# EAGLE design SDriveARM (EAGLE 7.7.0)
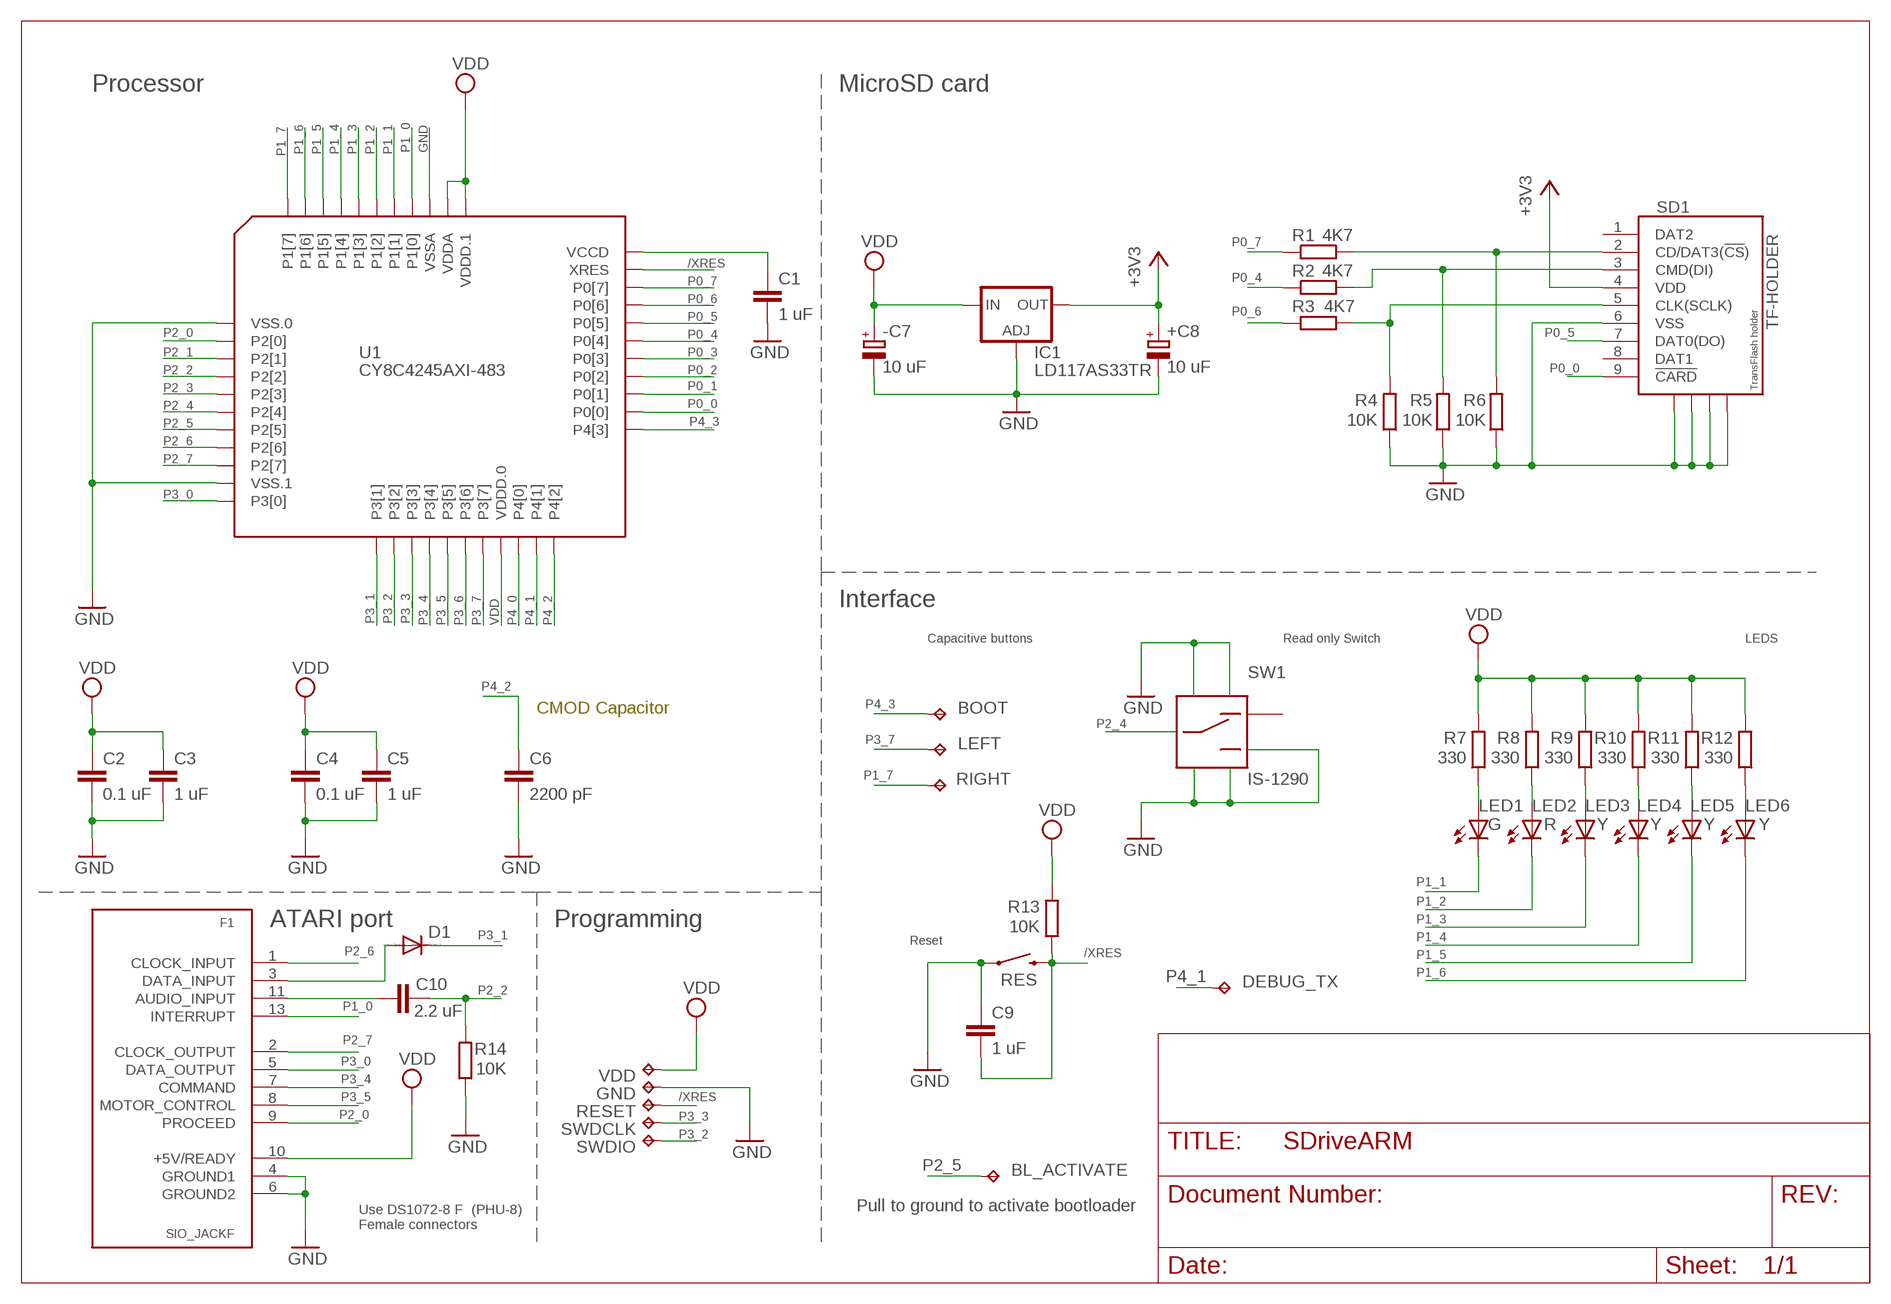
[diagram p0: schematic, sheet 1]

## Parts
+C8  10 uF  CPOL-EUA/3216-18W  [A/3216-18W]
-C7  10 uF  CPOL-EUA/3216-18W  [A/3216-18W]
BL_ACTIVATE  TPB1,27  [B1,27]
BOOT  TPTP20SQ  [TP20SQ]
C1  1 uF  C-EUC0603  [C0603]
C2  0.1 uF  C-EUC0603  [C0603]
C3  1 uF  C-EUC0603  [C0603]
C4  0.1 uF  C-EUC0603  [C0603]
C5  1 uF  C-EUC0603  [C0603]
C6  2200 pF  C-EUC0603  [C0603]
C9  1 uF  C-EUC0603  [C0603]
C10  2.2 uF  C-EUC0603  [C0603]
D1  MBR0520LT  [SOD123]
DEBUG_TX  TPB1,27  [B1,27]
F1  SIO_JACKF  [SIO_JACK_F]
GND  TPB1,27  [B1,27]
IC1  LD117AS33TR  [SOT223]
LED1  G  LEDSML0805  [SML0805]
LED2  R  LEDSML0805  [SML0805]
LED3  Y  LEDSML0805  [SML0805]
LED4  Y  LEDSML0805  [SML0805]
LED5  Y  LEDSML0805  [SML0805]
LED6  Y  LEDSML0805  [SML0805]
LEFT  TPTP20SQ  [TP20SQ]
R1  4K7  R-EU_R0603  [R0603]
R2  4K7  R-EU_R0603  [R0603]
R3  4K7  R-EU_R0603  [R0603]
R4  10K  R-EU_R0603  [R0603]
R5  10K  R-EU_R0603  [R0603]
R6  10K  R-EU_R0603  [R0603]
R7  330  R-EU_R0603  [R0603]
R8  330  R-EU_R0603  [R0603]
R9  330  R-EU_R0603  [R0603]
R10  330  R-EU_R0603  [R0603]
R11  330  R-EU_R0603  [R0603]
R12  330  R-EU_R0603  [R0603]
R13  10K  R-EU_R0603  [R0603]
R14  10K  R-EU_R0603  [R0603]
RES  SWITCH-MOMENTARY-2  [TACTILE_SWITCH_TALL]
RESET  TPB1,27  [B1,27]
RIGHT  TPTP20SQ  [TP20SQ]
SD1  TF-HOLDER  [TF-PULL]
SW1  IS-1290  [IS-1290]
SWDCLK  TPB1,27  [B1,27]
SWDIO  TPB1,27  [B1,27]
U1  CY8C4245AXI-483  [TQFP44]
VDD  TPB1,27  [B1,27]

## Nets
+3V3: +C8.+ IC1.4(OUT) SD1.4(VDD)
/XRES: C9.2 R13.1 RES.B2 RESET.TP U1.32(XRES)
GND: +C8.- -C7.- C1.2 C2.2 C3.2 C4.2 C5.2 C6.2 C9.1 F1.4(GROUND1) F1.6(GROUND2) GND.TP IC1.1(ADJ) R4.1 R5.1 R6.1 R14.1 RES.A2 SD1.6(VSS) SD1.S1 SD1.S2 SD1.S3 SD1.S4 SW1.POS2 SW1.SHIELD$1 SW1.SHIELD$2 SW1.SHIELD$3 SW1.SHIELD$4 U1.1(VSS.0) U1.10(VSS.1) U1.36(VSSA)
N$1: C1.1 U1.33(VCCD)
N$2: C10.2 F1.11(AUDIO_INPUT)
N$3: D1.A F1.3(DATA_INPUT)
N$11: R1.2 R6.2 SD1.2(CD/DAT3(!CS!))
N$12: R2.2 R5.2 SD1.3(CMD(DI))
N$13: R3.2 R4.2 SD1.5(CLK(SCLK))
N$18: LED1.A R7.1
N$19: LED2.A R8.1
N$23: LED3.A R9.1
N$24: LED4.A R10.1
N$25: LED5.A R11.1
N$26: LED6.A R12.1
P0_0: SD1.9(!CARD) U1.24(P0[0])
P0_1: U1.25(P0[1])
P0_2: U1.26(P0[2])
P0_3: U1.27(P0[3])
P0_4: R2.1 U1.28(P0[4])
P0_5: SD1.7(DAT0(DO)) U1.29(P0[5])
P0_6: R3.1 U1.30(P0[6])
P0_7: R1.1 U1.31(P0[7])
P1_0: F1.13(INTERRUPT) U1.37(P1[0])
P1_1: LED1.C U1.38(P1[1])
P1_2: LED2.C U1.39(P1[2])
P1_3: LED3.C U1.40(P1[3])
P1_4: LED4.C U1.41(P1[4])
P1_5: LED5.C U1.42(P1[5])
P1_6: LED6.C U1.43(P1[6])
P1_7: RIGHT.TP U1.44(P1[7])
P2_0: F1.9(PROCEED) U1.2(P2[0])
P2_1: U1.3(P2[1])
P2_2: C10.1 R14.2 U1.4(P2[2])
P2_3: U1.5(P2[3])
P2_4: SW1.COMMON U1.6(P2[4])
P2_5: BL_ACTIVATE.TP U1.7(P2[5])
P2_6: F1.1(CLOCK_INPUT) U1.8(P2[6])
P2_7: F1.2(CLOCK_OUTPUT) U1.9(P2[7])
P3_0: F1.5(DATA_OUTPUT) U1.11(P3[0])
P3_1: D1.C U1.12(P3[1])
P3_2: SWDIO.TP U1.13(P3[2])
P3_3: SWDCLK.TP U1.14(P3[3])
P3_4: F1.7(COMMAND) U1.15(P3[4])
P3_5: F1.8(MOTOR_CONTROL) U1.16(P3[5])
P3_6: U1.17(P3[6])
P3_7: LEFT.TP U1.18(P3[7])
P4_0: U1.20(P4[0])
P4_1: DEBUG_TX.TP U1.21(P4[1])
P4_2: C6.1 U1.22(P4[2])
P4_3: BOOT.TP U1.23(P4[3])
VDD: -C7.+ C2.1 C3.1 C4.1 C5.1 F1.10(+5V/READY) IC1.3(IN) R7.2 R8.2 R9.2 R10.2 R11.2 R12.2 R13.2 U1.19(VDDD.0) U1.34(VDDD.1) U1.35(VDDA) VDD.TP
Unconnected: SD1.1(DAT2) SD1.8(DAT1) SW1.POS1

## Notes on the sheet
- Processor | MicroSD card
- Interface
- Capacitive buttons | Read only Switch | LEDS
- CMOD Capacitor
- ATARI port | Programming
- Reset
- Pull to ground to activate bootloader
- Use DS1072-8 F  (PHU-8) 
  Female connectors

## Library data of the parts
+C8 -C7 = resistor:CPOL-EU: POLARIZED CAPACITOR, European symbol
BL_ACTIVATE BOOT DEBUG_TX GND LEFT RESET RIGHT SWDCLK SWDIO VDD = testpad:TP: Test pad
C1-C6 C9 C10 = resistor:C-EU: CAPACITOR, European symbol
D1 = diode:MBR0520LT: SCHOTTKY BARRIER RECTIFIER Source: http://onsemi.com .. MBR0520LT1-D.pdf
F1 = atari:SIO_JACK: SIO Jack
IC1 = v-reg:LD117A?*: Low drop fixed and adjustable positive voltage regulators 1 A Source: http://www.st.com/stonline/products/literature/ds/7194/ld1117axx.pdf
LED1-LED6 = led:LED: LED OSRAM: - CHIPLED LG R971, LG N971, LY N971, LG Q971, LY Q971, LO R971, LY R971 LH N974, LH R974 LS Q976, LO Q976, LY Q976 LO Q996 - Hyper CHIPLED LW Q18S LB Q993, LB Q99A, LB R99A - SideLED LS A670, LO A670, LY A670, LG A670, LP A670 LB A673, LV A673, LT A673, LW A673 LH A674 LY A675 LS A676, LA A676, LO A676, LY A676, LW A676 LS A679, LY A679, LG A679 - Hyper Micro SIDELED® LS Y876, LA Y876, LO Y876, LY Y876 LT Y87S - SmartLED LW L88C, LW L88S LB L89C, LB L89S, LG L890 LS L89K, LO L89K, LY L89K LS L896, LA L896, LO L896, LY L896 - TOPLED LS T670, LO T670, LY T670, LG T670, LP T670 LSG T670, LSP T670, LSY T670, LOP T670, LYG T670 LG T671, LOG T671, LSG T671 LB T673, LV T673, LT T673, LW T673 LH T674 LS T676, LA T676, LO T676, LY T676, LB T676, LH T676, LSB T676, LW T676 LB T67C, LV T67C, LT T67C, LS T67K, LO T67K, LY T67K, LW E67C LS E67B, LA E67B, LO E67B, LY E67B, LB E67C, LV E67C, LT E67C LW T67C LS T679, LY T679, LG T679 LS T770, LO T770, LY T770, LG T770, LP T770 LB T773, LV T773, LT T773, LW T773 LH T774 LS E675, LA E675, LY E675, LS T675 LS T776, LA T776, LO T776, LY T776, LB T776 LHGB T686 LT T68C, LB T68C - Hyper Mini TOPLED® LB M676 - Mini TOPLED Santana® LG M470 LS M47K, LO M47K, LY M47K Source: http://www.osram.convergy.de LUXEON: - LUMILED® LXK2-PW12-R00, LXK2-PW12-S00, LXK2-PW14-U00, LXK2-PW14-V00 LXK2-PM12-R00, LXK2-PM12-S00, LXK2-PM14-U00 LXK2-PE12-Q00, LXK2-PE12-R00, LXK2-PE12-S00, LXK2-PE14-T00, LXK2-PE14-U00 LXK2-PB12-K00, LXK2-PB12-L00, LXK2-PB12-M00, LXK2-PB14-N00, LXK2-PB14-P00, LXK2-PB14-Q00 LXK2-PR12-L00, LXK2-PR12-M00, LXK2-PR14-Q00, LXK2-PR14-R00 LXK2-PD12-Q00, LXK2-PD12-R00, LXK2-PD12-S00 LXK2-PH12-R00, LXK2-PH12-S00 LXK2-PL12-P00, LXK2-PL12-Q00, LXK2-PL12-R00 Source: www.luxeon.com KINGBRIGHT: KA-3528ASYC Source: www.kingbright.com
R1-R14 = resistor:R-EU_: RESISTOR, European symbol
RES = SparkFun-Electromechanical:SWITCH-MOMENTARY-2: Various NO switches- pushbuttons, reed, etc
SD1 = sd-mmc:TF-HOLDER: TF / Micro SD socket is PUSH-PUSH type, the card can be pushed into and auto locked and pushed out by simply press the card. Surface Mounting type.
SW1 = is-1290:IS-1290
U1 = cypresspsoc_my:CY8C4245AXI-483

## Board
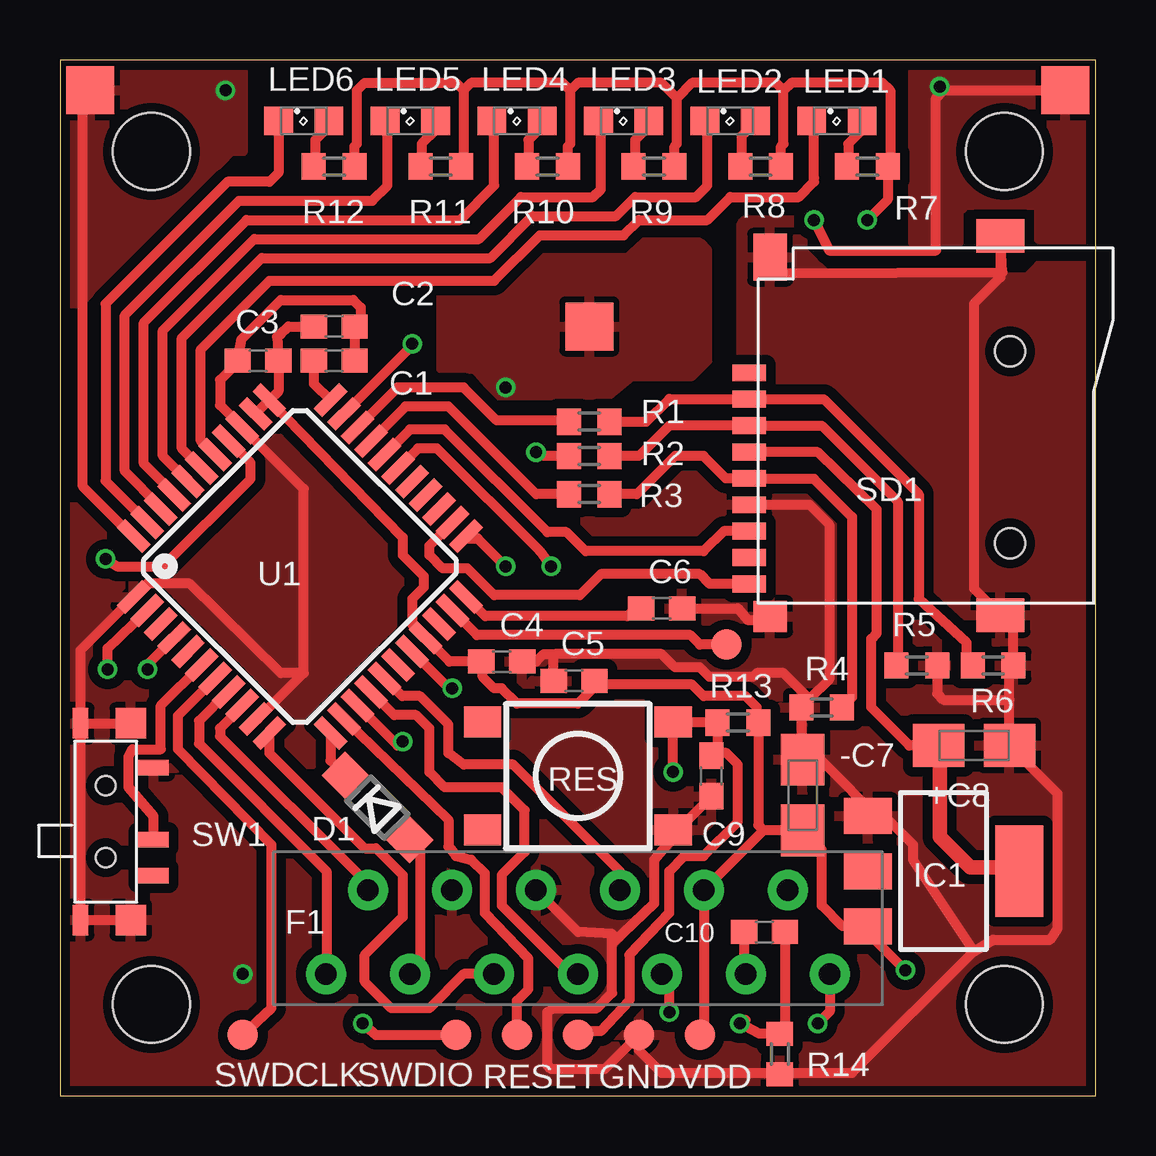
[diagram p1: board, top side]
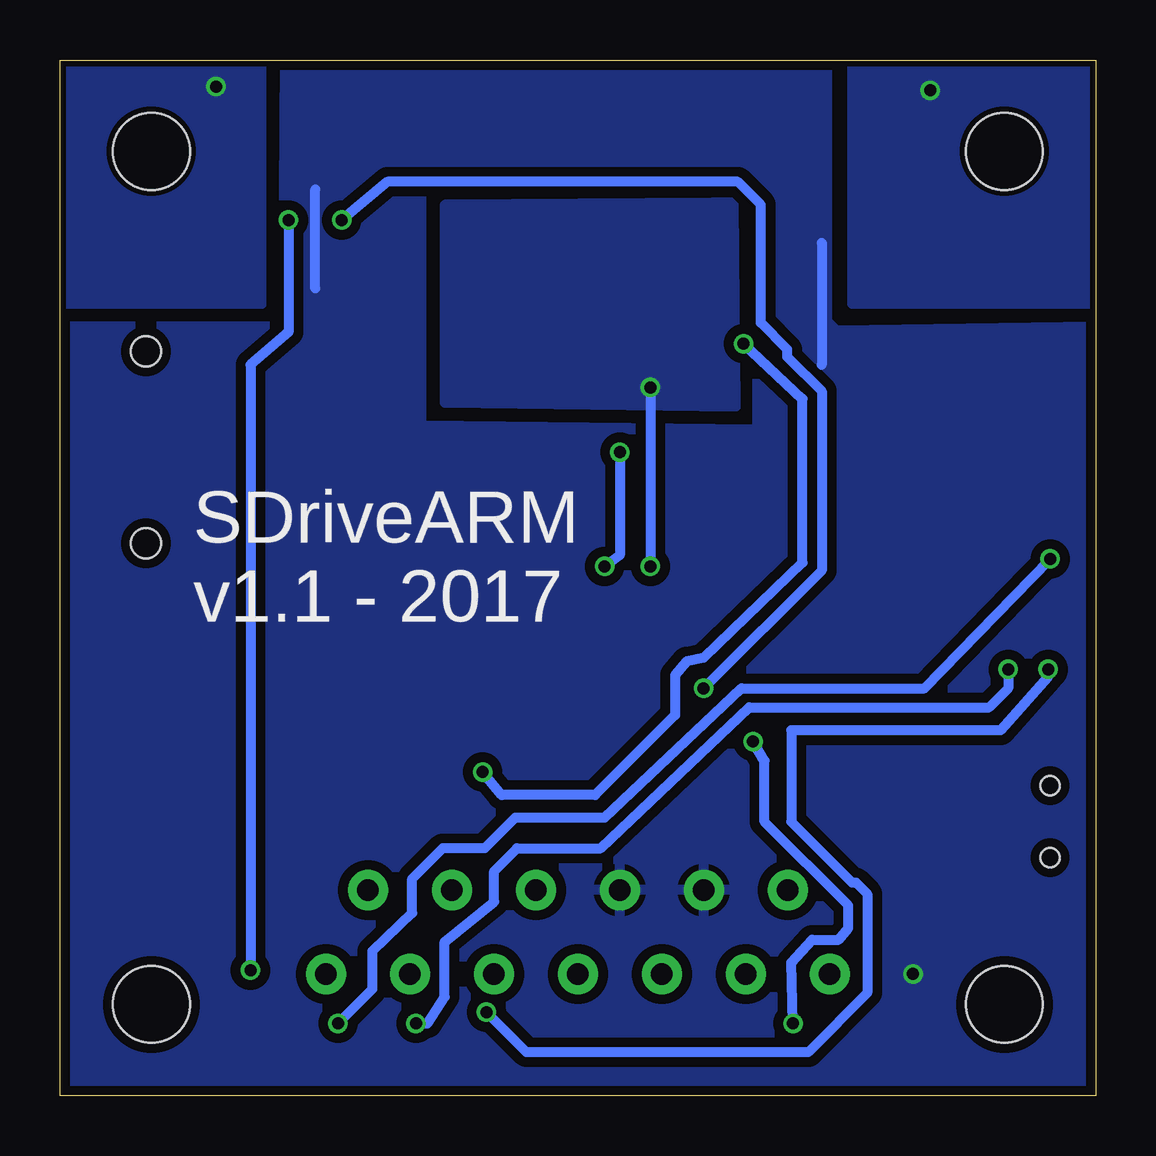
[diagram p2: board, bottom side, seen from below]

Size 43.18 x 43.18 mm. Coordinates in mm from the lower left corner, seen from the top.
Outline: 0,0 43.18,0 43.18,43.18 0,43.18 0,0
Copper layers (1*16): Top 0.035mm / dielectric 1.5mm / Bottom 0.035mm
Design rules "SeeedStudio_2layer_DRU_no_angle_20140221": minimum track width 6mil, minimum drill 12mil, track to track 6mil, track to pad 6mil, pad to pad 6mil, via to via 6mil, smd to smd 0mil, copper to edge 10mil, drill to drill 10mil, minimum pad ring 10mil, minimum via ring 6mil, stop-mask expansion 2mil, vias tented up to drill 100mil, thermal gap 10mil
Holes 3.2 mm at 3.81,3.81 3.81,3.81 39.37,3.81 3.81,39.37 39.37,39.37

### Footprints (pad centres in the part's own frame; a part is rotated, then mirrored left to right if it is on the bottom)
A/3216-18W = smd 2.15 x 1.8: + 1.475,0; - -1.475,0
B1,27 = smd 1.27 x 1.27: TP 0,0
TP20SQ = smd 2 x 2: TP 0,0
C0603 = smd 1.1 x 1: 1 -0.85,0; 2 0.85,0
SOD123 = smd 1.4 x 1.4: A 1.9,0; C -1.9,0
SIO_JACK_F = drill 0.9 pad 1.676: 1 -10.5,0; 2 -8.75,3.5; 3 -7,0; 4 -5.25,3.5; 5 -3.5,0; 6 -1.75,3.5; 7 0,0; 8 1.75,3.5; 9 3.5,0; 10 5.25,3.5; 11 7,0; 12 8.75,3.5; 13 10.5,0
SOT223 = smd 1.5 x 2: 1 -2.3,-3.15; 2 0,-3.15; 3 2.3,-3.15 | smd 3.8 x 2: 4 0,3.15
SML0805 = smd 1.2 x 1.2: A 1.05,0; C -1.05,0
R0603 = smd 1 x 1.1: 1 -0.85,0; 2 0.85,0
TACTILE_SWITCH_TALL = smd 1.55 x 1.3: A1 -3.975,-2.25; A2 3.975,-2.25; B1 -3.975,2.25; B2 3.975,2.25
TF-PULL = smd 0.7 x 1.4: 1 -2.2,-7.62; 2 -1.1,-7.62; 3 0,-7.62; 4 1.1,-7.62; 5 2.2,-7.62; 6 3.3,-7.62; 7 4.4,-7.62; 8 5.5,-7.62; 9 6.6,-7.62 | smd 1.4 x 2: S1 -7.9,2.85; S2 7.9,2.85 | smd 1.28 x 1.4: S3 7.96,-6.75 | smd 1.95 x 1.4: S4 -7.025,-6.75 | hole 1.25: -3.1,3.25; 4.9,3.25
IS-1290 = smd 0.635 x 1.27: COMMON 0.75,2; POS1 2.25,2; POS2 -2.25,2 | smd 1.27 x 1.27: SHIELD$1 -4.1,1.05; SHIELD$4 4.1,1.05 | smd 1.27 x 0.66: SHIELD$2 -4.1,-1.05; SHIELD$3 4.1,-1.05 | hole 0.8: 1.5,0; -1.5,0
TQFP44 = smd 1.5 x 0.5: 1 -5.8,4; 2 -5.8,3.2; 3 -5.8,2.4; 4 -5.8,1.6; 5 -5.8,0.8; 6 -5.8,0; 7 -5.8,-0.8; 8 -5.8,-1.6; 9 -5.8,-2.4; 10 -5.8,-3.2; 11 -5.8,-4; 23 5.8,-4; 24 5.8,-3.2; 25 5.8,-2.4; 26 5.8,-1.6; 27 5.8,-0.8; 28 5.8,0; 29 5.8,0.8; 30 5.8,1.6; 31 5.8,2.4; 32 5.8,3.2; 33 5.8,4 | smd 0.5 x 1.5: 12 -4,-5.8; 13 -3.2,-5.8; 14 -2.4,-5.8; 15 -1.6,-5.8; 16 -0.8,-5.8; 17 0,-5.8; 18 0.8,-5.8; 19 1.6,-5.8; 20 2.4,-5.8; 21 3.2,-5.8; 22 4,-5.8; 34 4,5.8; 35 3.2,5.8; 36 2.4,5.8; 37 1.6,5.8; 38 0.8,5.8; 39 0,5.8; 40 -0.8,5.8; 41 -1.6,5.8; 42 -2.4,5.8; 43 -3.2,5.8; 44 -4,5.8

### Placement (x,y rotation side)
+C8  38.1,14.61 180 top
-C7  30.96,12.54 270 top
BL_ACTIVATE  7.62,2.54 0 top
BOOT  22.07,32.07 0 top
C1  11.43,30.64 0 top
C2  11.43,32.07 0 top
C3  8.26,30.64 180 top
C4  18.41,18.1 0 top
C5  21.43,17.3 180 top
C6  25.08,20.32 0 top
C9  27.15,13.34 90 top
C10  29.37,6.83 180 top
D1  13.24,12.02 315 top
DEBUG_TX  27.78,18.81 0 top
F1  21.59,5.08 0 top
GND  24.13,2.54 0 top
IC1  36.83,9.37 270 top
LED1  32.38,40.64 0 top
LED2  27.94,40.64 0 top
LED3  23.5,40.64 0 top
LED4  19.05,40.64 0 top
LED5  14.61,40.64 0 top
LED6  10.16,40.64 0 top
LEFT  41.91,41.91 0 top
R1  22.07,28.1 0 top
R2  22.07,26.67 0 top
R3  22.07,25.08 0 top
R4  31.75,16.19 0 top
R5  35.72,17.94 180 top
R6  38.89,17.94 180 top
R7  33.66,38.73 0 top
R8  29.21,38.73 0 top
R9  24.77,38.73 0 top
R10  20.32,38.73 0 top
R11  15.88,38.73 0 top
R12  11.43,38.73 0 top
R13  28.26,15.56 0 top
R14  30,1.75 90 top
RES  21.59,13.34 0 top
RESET  21.59,2.54 0 top
RIGHT  1.27,41.91 0 top
SD1  36.35,27.94 270 top
SW1  1.91,11.43 270 top
SWDCLK  16.51,2.54 0 top
SWDIO  19.05,2.54 0 top
U1  10,22.07 45 top
VDD  26.67,2.54 0 top

### Tracks (layer width: path | path; a pad name or v marks a point on that pad's centre or on a via)
+3V3
  Top 0.406: +C8.+ 35.4,14.61 33.81,16.19 33.81,19.05 34.05,19.29 34.05,24.45 31.59,26.83 28.75,26.83 SD1.4 | IC1.4 39.53,9.37 39.37,9.53
  Top 0.61: 36.51,14.49 +C8.+ 36.67,14.56 36.67,10.79 37.94,9.53 39.37,9.53 40.01,9.53
/XRES  (via drill 0.5 pad 0.81)
  Top 0.406: RES.B2 27.38,15.59 R13.1 27.41,14.45 C9.2 | 27.41,13.92 C9.2 | 21.59,2.7 RESET.TP 21.75,2.7 22.54,2.7 23.73,3.97 23.73,5.87 25.4,7.62 25.4,9.37 26.04,10 26.83,10 28.26,11.43 28.26,13.81 27.78,14.29 27.25,14.29 C9.2 | 25.72,15.43 RES.B2 | v14.68,31.35 14.68,31.27 U1.32 | v25.56,13.49 RES.B2
  Bottom 0.406: v14.68,31.35 12.22,29.05 12.22,22.23 16.35,18.26 17.07,18.1 17.54,17.54 17.54,15.88 20.88,12.54 24.77,12.54 v25.56,13.49
GND  (via drill 0.5 pad 0.81)
  Top 0.406: C1.2 C2.2 12.54,32.28 12.54,32.86 12.22,33.18 9.21,33.18 7.56,31.54 C3.2 7.56,30.74 6.67,29.84 6.67,28.79 U1.36 10.16,25.3 10.16,17.62 | 30,20.38 SD1.S3 29.47,19.84 28.65,19.84 28.26,20.32 C6.2 | SD1.6 31.24,24.64 32.07,23.81 32.07,17.36 31.25,16.54 | 31.25,16.54 R4.1 30.9,14.07 -C7.- 31.7,14.02 34.29,11.43 33.92,11.43 IC1.1 34.37,11.67 35.56,10.48 35.56,9.84 38.1,6.03 | 38.1,6.03 38.89,6.51 41.27,6.51 41.59,6.99 41.59,12.59 +C8.- 39.58,16.51 | 39.58,16.51 39.58,17.77 R6.1 39.74,19.5 SD1.S2 38.1,21.14 38.1,33.02 39.2,34.12 SD1.S1 39.28,34.33 30.48,34.29 30,34.29 29.6,34.69 SD1.S4 | U1.10 8.24,15.7 10.16,17.62 | SW1.SHIELD$2 0.85,18.58 U1.1 3.63,21.35 5.4,21.35 9.21,17.62 10.16,17.62 | SW1.SHIELD$2 SW1.SHIELD$1 | SW1.SHIELD$2 SW1.SHIELD$3 SW1.SHIELD$4 | R5.1 36.57,16.77 36.83,16.51 39.58,16.51 | C4.2 19.84,18.1 20.16,18.41 20.64,18.41 | 31.25,16.54 30.16,17.62 29.05,17.62 28.89,17.46 27.07,17.46 26.67,17.86 25.64,17.86 25.08,18.41 20.64,18.41 | C9.1 25.77,11.11 25.59,11.11 RES.A2 25.57,10.8 24.77,9.84 24.77,8.02 23.02,6.35 | F1.6 21.59,6.83 23.02,6.75 23.02,6.35 | 29.84,0.95 25.08,0.95 24.13,1.91 GND.TP 22.7,1.11 20.48,1.11 20.32,1.27 20.32,3.49 20.56,3.65 22.38,3.65 23.02,4.29 23.02,6.35 | 29.84,0.95 33.02,0.95 38.1,6.03 | R14.1 29.9,0.9 29.84,0.95 | C5.2 20.58,18.36 20.64,18.41
  Bottom 0.406: 11.43,35.56 11.43,30.48 | 32.54,33.66 32.54,37.78
  other vias: 7.62,5.08
  pour Top (isolate 0.406): 0,0 0,27.94 26.04,27.94 28.42,30.32 28.42,36.35 28.57,36.51 30.64,36.51 30.96,36.2 30.96,35.24 32.07,34.13 40.32,34.13 40.8,34.61 43.02,34.61 43.18,34.45 43.18,0
  pour Bottom (isolate 0.406): 0,0 0,32.07 10.79,31.91 11.27,32.38 14.13,32.38 14.13,27.78 28.1,27.94 28.1,32.54 33.02,32.54 33.66,32.07 43.18,32.07 43.18,0
  pour Bottom (isolate 0.406): 11.19,31.43 11.19,43.26 33.81,43.26 33.89,31.91 28.1,31.91 28.1,38.1 14.05,38.1 13.97,31.35
N$1
  Top 0.406: C1.1 10.58,29.69 U1.33
N$2
  Top 0.406: C10.2 28.52,5.15 F1.11
N$3
  Top 0.406: 14.58,10.03 D1.A 15,10.25 15,5.49 F1.3
N$11
  Top 0.406: R6.2 37.78,18.2 37.78,18.89 35.8,20.72 35.8,25.08 31.84,29.04 SD1.2 25.4,29.05 24.45,28.1 R1.2
N$12
  Top 0.406: R2.2 24.13,26.67 25.4,27.94 SD1.3 31.75,27.94 34.92,24.77 34.92,18 R5.2
N$13
  Top 0.406: R4.2 33.02,16.61 33.02,24.13 31.43,25.72 28.76,25.72 SD1.5 27.76,25.74 26.83,26.67 25.64,26.67 24.05,25.08 R3.2
N$18
  Top 0.406: LED1.A 33.44,40.26 32.86,39.69 32.86,38.79 R7.1
N$19
  Top 0.406: LED2.A 28.99,40.58 28.42,40.01 28.42,38.79 R8.1
N$23
  Top 0.406: LED3.A 24.55,40.42 23.97,39.85 23.97,38.79 R9.1
N$24
  Top 0.406: LED4.A 20.1,40.42 19.53,39.85 19.53,38.79 R10.1
N$25
  Top 0.406: LED5.A 15.65,40.26 15.08,39.69 15.08,38.79 R11.1
N$26
  Top 0.406: LED6.A 11.21,40.42 10.64,39.85 10.64,38.79 R12.1
P0_0
  Top 0.406: 28.82,21.43 SD1.9 27.08,21.34 26.67,21.75 22.54,21.75 21.67,20.88 18.1,20.88 16.99,21.99 15.95,21.99 15.4,22.54 15.4,22.94 U1.24
P0_4  (via drill 0.5 pad 0.81)
  Top 0.406: R2.1 20.16,26.67 v19.84,26.83 | U1.28 14.92,26.99 15.72,26.99 20,22.7 v20.48,22.07
  Bottom 0.406: v19.84,26.83 19.84,22.54 v20.48,22.07
P0_5
  Top 0.406: U1.29 14.59,27.78 16.03,27.78 20.32,23.5 21.11,23.5 21.91,22.7 26.83,22.7 27.67,23.54 SD1.7
P0_6
  Top 0.406: R3.1 19.84,25.08 16.19,28.73 14.41,28.73 U1.30
P0_7
  Top 0.406: 12.47,27.86 U1.31 14.07,29.53 16.83,29.53 18.2,28.16 20.74,28.16 R1.1
P1_0  (via drill 0.5 pad 0.81)
  Top 0.406: F1.13 32.09,3.52 v31.59,3.02 | v1.91,22.38 2.38,22.07 4.29,22.07 7.94,25.72 7.94,26.39 U1.37
  Bottom 0.406: v1.91,22.38 7.14,16.99 14.76,16.99 20.48,11.59 24.21,11.59 25.48,10.32 27.23,10.32 28.5,9.05 28.5,7.62 30.16,6.03 30.16,4.45 v31.59,3.02
P1_1
  Top 0.406: U1.38 6.45,26.73 5.87,27.3 5.87,31.11 8.73,33.97 18.1,33.97 20,35.88 23.5,35.88 24.13,36.51 26.99,36.51 27.94,37.47 30.8,37.47 31.43,38.1 31.43,38.26 31.43,40.54 LED1.C
P1_2
  Top 0.406: U1.39 | U1.39 5.08,26.99 5.08,31.59 8.41,34.92 17.94,34.92 19.68,36.67 23.18,36.67 23.97,37.47 26.51,37.47 26.99,37.94 26.99,40.54 LED2.C
P1_3
  Top 0.406: U1.40 5.33,25.62 4.29,26.67 4.29,31.91 8.1,35.72 17.46,35.72 19.21,37.47 22.23,37.47 22.54,37.78 22.54,40.54 LED3.C 22.38,40.58
P1_4
  Top 0.406: U1.41 4.77,25.08 3.49,26.35 3.49,32.23 7.78,36.51 16.67,36.51 18.1,37.94 18.1,40.54 LED4.C
P1_5
  Top 0.406: U1.42 4.2,24.53 2.7,26.04 2.7,32.54 7.46,37.31 13.02,37.31 13.65,37.94 13.65,40.54 LED5.C
P1_6
  Top 0.406: LED6.C 9.11,38.48 8.73,38.1 6.99,38.1 1.91,33.02 1.91,25.64 U1.43
P1_7  (via drill 0.5 pad 0.81)
  Top 0.406: 1.11,41.75 RIGHT.TP 0.95,41.59 0.95,25.4 3.01,23.34 U1.44
  other vias: 6.91,41.91
  pour Top (isolate 0.406): 0,33.02 0,43.18 7.62,43.18 7.62,39.37 7.14,39.37 6.67,38.89 0.79,33.02
  pour Bottom: 0,43.18 10.16,43.18 10.16,33.02 0,33.02
P2_0  (via drill 0.5 pad 0.81)
  Top 0.406: v1.98,17.78 1.98,18.65 U1.2 | v25.4,3.49 25.4,4.77 F1.9
  Bottom 0.406: v1.98,17.78 1.98,17.46 3.97,15.24 12.7,15.24 12.7,11.43 10.16,8.89 10,8.89 9.53,8.41 9.53,4.29 11.99,1.83 23.73,1.83 v25.4,3.49
P2_2  (via drill 0.5 pad 0.81)
  Top 0.406: v3.65,17.78 3.65,17.98 U1.4 | 28.59,3.16 v28.34,3.02 29.15,2.6 R14.2 30.22,2.81 C10.1
  Bottom 0.406: v28.34,3.02 27.86,3.02 27.15,4.13 27.15,6.43 25.08,8.1 25.08,9.37 24.13,10.32 20.64,10.32 14.45,16.19 4.45,16.19 3.65,16.99 v3.65,17.78
P2_4
  Top 0.406: SW1.COMMON 3.9,11.65 2.86,12.86 2.86,14.13 3.02,14.45 4.21,14.45 4.21,16.27 U1.6
P2_5
  Top 0.406: 7.62,2.62 BL_ACTIVATE.TP 8.81,3.65 8.81,10.48 4.92,14.45 4.92,15.86 U1.7
P2_6
  Top 0.406: U1.8 6.99,16.83 5.79,15.64 5.79,14.68 11.11,9.37 11.11,5.1 F1.1
P2_7
  Top 0.406: 12.84,8.75 F1.2 12.46,8.96 12.46,9.21 6.68,14.99 6.67,14.99 6.67,15.32 7.6,16.25 U1.9
P3_0
  Top 0.406: F1.5 16.83,5.08 15.4,3.65 13.81,3.65 12.7,4.76 12.7,5.87 14.29,7.46 14.29,9.21 13.18,10.32 12.7,10.32 8.73,14.29 U1.11
P3_1
  Top 0.406: U1.12 11.27,13.98 D1.C
P3_2
  Top 0.406: SWDIO.TP 19.05,3.97 19.53,4.45 19.53,5.71 17.7,7.62 17.7,9.29 17.14,9.84 16.51,10 16.19,10.4 16.19,11.51 U1.13
P3_3  (via drill 0.5 pad 0.81)
  Top 0.406: v12.62,3.02 13.18,2.54 SWDCLK.TP | v14.29,14.76 14.07,14.61 U1.14
  Bottom 0.406: v12.62,3.02 12.7,5.56 11.83,6.51 10.72,6.51 10.32,6.99 10.32,7.94 13.81,11.43 13.81,13.97 v14.29,14.76
P3_4
  Top 0.406: U1.15 13.93,15.88 14.84,15.88 15.4,15.32 15.4,13.49 16.03,12.86 18.41,12.86 19.37,11.91 19.37,10.16 18.41,9.21 18.41,7.94 20.95,5.4 21.43,5.24 F1.7
P3_5
  Top 0.406: F1.8 23.34,9.36 18.89,13.81 16.83,13.81 16.19,14.29 16.19,15.48 15,16.67 14.27,16.67 U1.16
P3_7  (via drill 0.5 pad 0.81)
  Top 0.406: v16.35,16.99 16.21,16.99 U1.18 | LEFT.TP 36.83,41.91 36.51,41.59 36.51,35.24 32.07,35.24 v31.43,36.51
  Bottom 0.406: v16.35,16.99 11.43,21.91 11.43,29.37 12.86,30.8 12.86,31.11 13.97,32.23 13.97,37.15 14.92,38.1 29.53,38.1 v31.43,36.51
  other vias: 36.67,42.07
  pour Top (isolate 0.406): 35.56,43.18 35.56,35.56 37.47,35.56 37.47,36.99 37.62,36.99 37.62,37.15 40.8,37.15 40.8,35.72 43.18,35.72 43.18,43.18
  pour Bottom: 43.18,43.18 43.18,33.02 34.77,33.02 34.77,43.34
P4_1
  Top 0.406: DEBUG_TX.TP 26.67,18.81 26.27,19.21 17.38,19.21 U1.21
P4_2
  Top 0.406: C6.1 23.97,20.32 23.65,20 17.72,20 U1.22
P4_3  (via drill 0.5 pad 0.81)
  Top 0.406: U1.23 16.93,23.23 17.41,23.23 v18.57,22.07 | 21.75,31.75 BOOT.TP
  Bottom 0.406: v18.57,29.53 v18.57,22.07
  pour Top (isolate 0.406): 15.88,33.26 15.88,30.32 17.3,30.32 18.26,29.21 22.86,29.21 23.81,30 26.35,30 26.99,30.64 26.99,35.24 26.67,35.56 24.29,35.56 23.65,34.92 20.16,34.92 18.57,33.34
  pour Bottom (isolate 0.406): 15,28.73 15.08,37.23 16.03,37.23 27.15,37.15 27.15,28.89
VDD  (via drill 0.5 pad 0.81)
  Top 0.406: R12.2 12.28,39.59 12.38,39.69 12.38,41.91 12.7,42.23 16.51,42.23 16.83,41.91 | 16.83,41.91 16.83,38.84 R11.2 | R10.2 21.17,39.59 21.27,39.69 21.27,41.91 | 21.27,41.91 20.95,42.23 17.14,42.23 16.83,41.91 | R9.2 25.61,39.59 25.72,39.69 25.72,41.59 | 25.72,41.59 25.08,42.23 21.59,42.23 21.27,41.91 | R8.2 30.06,39.59 30.16,39.69 30.16,41.91 | 30.16,41.91 29.84,42.23 26.35,42.23 25.72,41.59 | 30.16,41.91 30.48,42.23 34.29,42.23 34.61,41.91 34.61,38.84 R7.2 34.51,37.36 v33.66,36.51 | U1.35 U1.34 | U1.34 9.11,29.37 C3.1 9.05,31.65 9.21,31.75 9.53,32.07 C2.1 | U1.19 15.19,19.1 | 29.33,11.07 F1.10 26.84,2.71 VDD.TP | 29.33,11.07 -C7.+ 31.75,10.27 31.75,7.94 32.62,7.07 IC1.3 33.68,6.8 v35.24,5.24 | 29.33,11.07 29.11,11.29 R13.2 29.05,15.61 29.05,16.19 28.57,16.67 26.83,16.67 26.35,17.14 22.44,17.14 C5.1 22.28,17.04 21.59,16.35 19.05,16.35 18.41,16.99 18.1,16.99 17.62,17.46 17.62,18.04 C4.1 16.23,18.1 U1.19 | U1.34 14.29,23.28 14.29,22.54 15.16,21.67 15.16,21.19 14.68,20.72 14.68,19.65 U1.19
  Bottom 0.406: v33.66,36.51 33.66,31.83 35.24,30.48 v35.24,5.24

### Text on the board
tNames: RES
bNames: SDriveARM / v1.1 - 2017